# Altium schematic sheet LCD.SchDoc
size A4
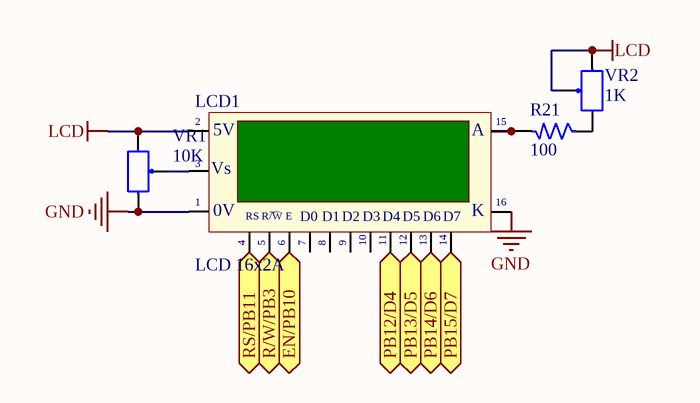
[diagram p0: LCD.SchDoc]

## Parts
LCD1  LCD 16x2A  [LCD16X2]
R21  100  [SM-1206]
VR1  10K  [VR]
VR2  1K  [VR]

## Ports
EN/PB10, PB12/D4, PB13/D5, PB14/D6, PB15/D7, R/W/PB3, RS/PB11

## Nets
GND: LCD1.1(GND) LCD1.16(K) VR1.3
LCD: LCD1.2(VDD) VR1.1 VR2.2 VR2.3
EN/PB10: LCD1.6(~{EN}) ; port EN/PB10
PB12/D4: LCD1.11(D4) ; port PB12/D4
PB13/D5: LCD1.12(D5) ; port PB13/D5
PB14/D6: LCD1.13(D6) ; port PB14/D6
PB15/D7: LCD1.14(D7) ; port PB15/D7
R/W/PB3: LCD1.5(R/~{W}) ; port R/W/PB3
RS/PB11: LCD1.4(RS) ; port RS/PB11
NetLCD1_3: LCD1.3(VEE) VR1.2
NetLCD1_15: LCD1.15(A) R21.2
NetR21_1: R21.1 VR2.1

Not connected (* = marked no-connect by the designer): LCD1 7(D0) 8(D1) 9(D2) 10(D3)

## Notes on the sheet
- (in symbol LCD16x2A) 5V; Vs; |; 0V; R/W; E

## Library data of the parts
LCD1 = LCD16x2A: LCD dipslay 16 char, 2 line; Value: LCD16x2A
R21 = R: Resistor 1/4W; Value: R1/4W - 1K
VR1 VR2 = VR: Var Resistor; Value: VR 10K